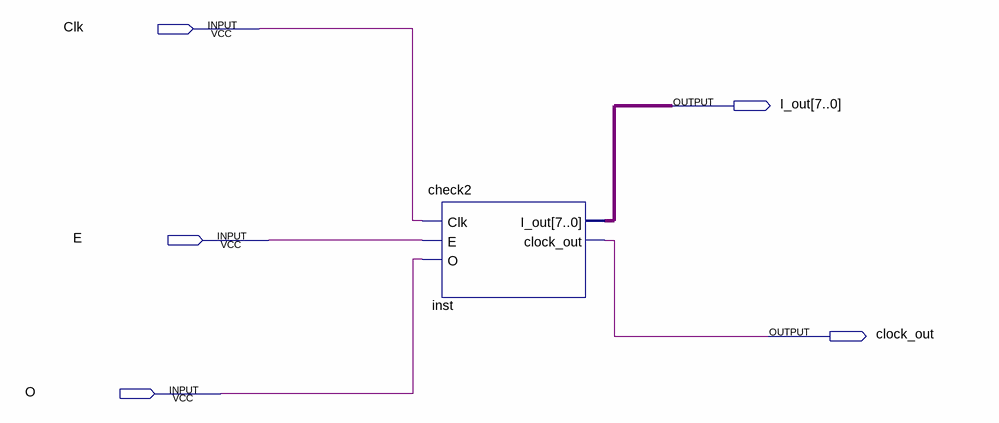
[diagram p0: schematic sheet]
// Quartus schematic Block2.bdf as structural Verilog: 1 symbols, 5 pins
module Block2 (
  input  Clk,
  input  E,
  input  O,
  output [7:0] I_out,
  output clock_out
);

  check2 inst (.Clk(Clk), .E(E), .O(O), .I_out(I_out), .clock_out(clock_out));
endmodule
